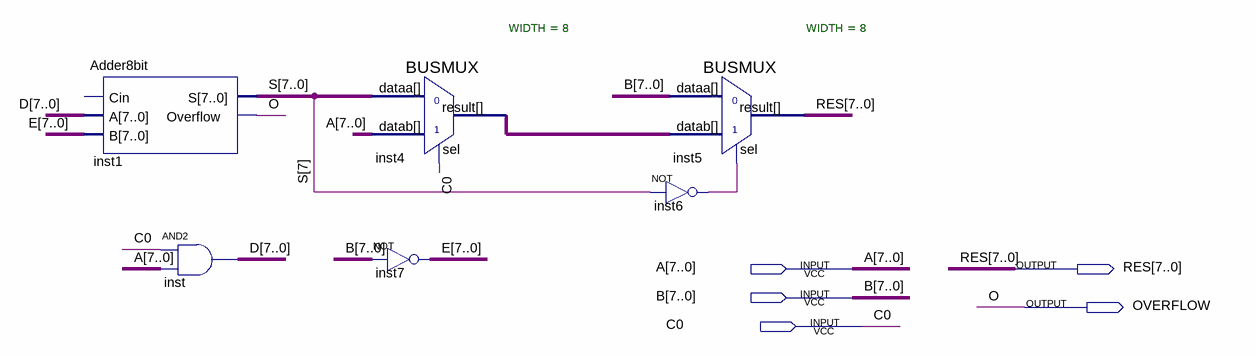
[diagram p0: schematic sheet]
// Quartus schematic ABS_MAX.bdf as structural Verilog: 6 symbols, 5 pins
module ABS_MAX (
  input  [7:0] A,
  input  [7:0] B,
  input  C0,
  output [7:0] RES,
  output OVERFLOW
);

  wire inst6_out;
  wire [7:0] D, E, inst4_result, S;

  Adder8bit inst1 (.A(D), .B(E), .S(S), .Overflow(OVERFLOW));  // open: Cin
  assign D = {8{C0}} & A;  // AND2 inst, 8 bits wide
  BUSMUX #(.WIDTH(8)) inst4 (.datab(A), .sel(C0), .dataa(S), .result(inst4_result));
  assign E = ~B;  // NOT inst7, 8 bits wide
  BUSMUX #(.WIDTH(8)) inst5 (.datab(inst4_result), .sel(inst6_out), .dataa(B), .result(RES));
  not inst6 (inst6_out, S[7]);

  // Other names for the same wires on the sheet: O = OVERFLOW
endmodule
